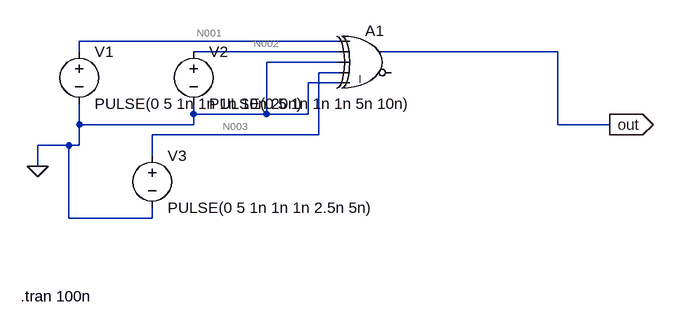
[diagram p0: schematic Draft2.asc]
Draft2.asc, the LTspice schematic file:
Version 4
SHEET 1 880 680
WIRE 80 96 -320 96
WIRE -320 112 -320 96
WIRE 80 112 -144 112
WIRE 416 112 144 112
WIRE 80 128 -32 128
WIRE 80 144 48 144
WIRE 80 160 32 160
WIRE -144 208 -144 192
WIRE -32 208 -32 128
WIRE -32 208 -144 208
WIRE 32 208 32 160
WIRE 32 208 -32 208
WIRE -320 224 -320 192
WIRE -144 224 -144 208
WIRE -144 224 -320 224
WIRE 416 224 416 112
WIRE 496 224 416 224
WIRE 48 240 48 144
WIRE 48 240 -208 240
WIRE -336 256 -384 256
WIRE -320 256 -320 224
WIRE -320 256 -336 256
WIRE -208 272 -208 240
WIRE -384 288 -384 256
WIRE -336 368 -336 256
WIRE -208 368 -208 352
WIRE -208 368 -336 368
FLAG -384 288 0
FLAG 496 224 out
IOPIN 496 224 Out
SYMBOL voltage -320 96 R0
WINDOW 123 0 0 Left 0
WINDOW 39 0 0 Left 0
SYMATTR InstName V1
SYMATTR Value PULSE(0 5 1n 1n 1n 10n 20n)
SYMBOL voltage -144 96 R0
WINDOW 123 0 0 Left 0
WINDOW 39 0 0 Left 0
SYMATTR InstName V2
SYMATTR Value PULSE(0 5 1n 1n 1n 5n 10n)
SYMBOL voltage -208 256 R0
WINDOW 123 0 0 Left 0
WINDOW 39 0 0 Left 0
SYMATTR InstName V3
SYMATTR Value PULSE(0 5 1n 1n 1n 2.5n 5n)
SYMBOL Digital\\xor 128 64 R0
SYMATTR InstName A1
TEXT -410 488 Left 2 !.tran 100n

The netlist it stands for:
* Draft2.asc
V1 N001 0 PULSE(0 5 1n 1n 1n 10n 20n)
V2 N002 0 PULSE(0 5 1n 1n 1n 5n 10n)
V3 N003 0 PULSE(0 5 1n 1n 1n 2.5n 5n)
A1 N001 N002 0 N003 0 0 out 0 XOR
.tran 100n
.backanno
.end

* Results of the author's LTspice run, read from the files saved beside the schematic
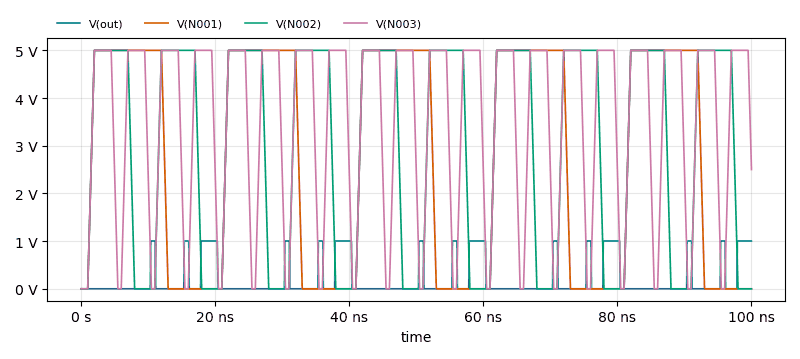
[diagram p1: Transient Analysis of Draft2.asc, plotted from the saved traces]
* Transient Analysis, 1 run:
*   V(out): min 0 V, max 1 V, average 195.5 mV, rms 442.1 mV, last 1 V
*   V(N001): min 0 V, max 5 V, average 2.75 V, rms 3.708 V, last 0 V
*   V(N002): min 0 V, max 5 V, average 3 V, rms 3.85 V, last 0 V
*   V(N003): min 0 V, max 5 V, average 3.494 V, rms 4.129 V, last 2.5 V